# Altium schematic sheet Kilobot_Controller_Hub&FTDI.SchDoc
size A4; PageSetup: Record=PageOptions|CenterHorizontal=True|CenterVertical=True|PrintScale=0.94|XCorrection=1.00|YCorrection=1.00|PrintKind=1|BorderSize=5000000|LeftOffset=0|BottomOffset=0|Orientation=2|PaperLength=1000|PaperWidth=1000|Scale=100|PaperSource=15|PrintQuality=600|MediaType=1|DitherType=10|PaperKind=Letter|PrintScaleMode=1
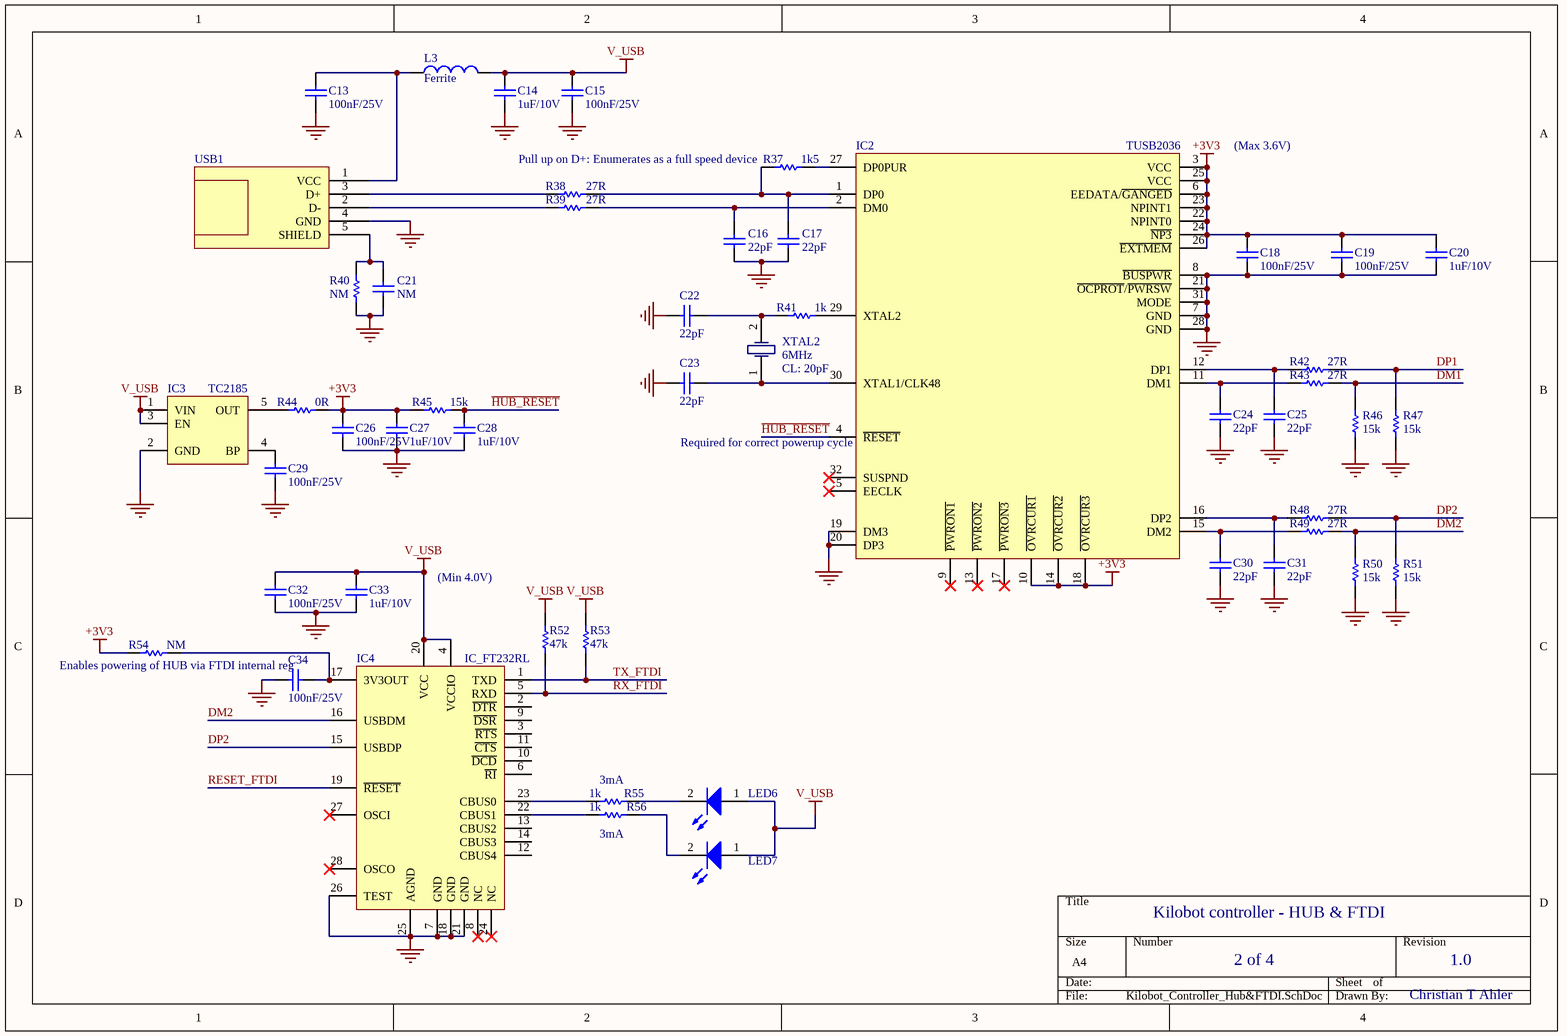
[diagram p0: Kilobot_Controller_Hub&FTDI.SchDoc]

## Parts
C13  value 100nF/25V  [RESC1608L]  (hidden comment: C0603)
C14  value 1uF/10V  [RESC1608L]  (hidden comment: C0603)
C15  value 100nF/25V  [RESC1608L]  (hidden comment: C0603)
C16  value 22pF  [RESC1608L]  (hidden comment: C0603)
C17  value 22pF  [RESC1608L]  (hidden comment: C0603)
C18  value 100nF/25V  [RESC1608L]  (hidden comment: C0603)
C19  value 100nF/25V  [RESC1608L]  (hidden comment: C0603)
C20  value 1uF/10V  [RESC1608L]  (hidden comment: C0603)
C21  value NM  [RESC1608L]  (hidden comment: C0603)
C22  value 22pF  [RESC1608L]  (hidden comment: C0603)
C23  value 22pF  [RESC1608L]  (hidden comment: C0603)
C24  value 22pF  [RESC1608L]  (hidden comment: C0603)
C25  value 22pF  [RESC1608L]  (hidden comment: C0603)
C26  value 100nF/25V  [RESC1608L]  (hidden comment: C0603)
C27  value 1uF/10V  [RESC1608L]  (hidden comment: C0603)
C28  value 1uF/10V  [RESC1608L]  (hidden comment: C0603)
C29  value 100nF/25V  [RESC1608L]  (hidden comment: C0603)
C30  value 22pF  [RESC1608L]  (hidden comment: C0603)
C31  value 22pF  [RESC1608L]  (hidden comment: C0603)
C32  value 100nF/25V  [RESC1608L]  (hidden comment: C0603)
C33  value 1uF/10V  [RESC1608L]  (hidden comment: C0603)
C34  value 100nF/25V  [RESC1608L]  (hidden comment: C0603)
IC2  TUSB2036  [TQFP32]
IC3  TC2185  [SOT23-5]
IC4  IC_FT232RL  [SSOP-28]
L3  Ferrite  [RESC2012N]
LED6  LED  [LED0603]  (value not drawn)
LED7  LED  [LED0603]  (value not drawn)
R37  value 1k5  [RESC1608L]  (hidden comment: Res1)
R38  value 27R  [RESC1608L]  (hidden comment: Res1)
R39  value 27R  [RESC1608L]  (hidden comment: Res1)
R40  value NM  [RESC1608L]  (hidden comment: Res1)
R41  value 1k  [RESC1608L]  (hidden comment: Res1)
R42  value 27R  [RESC1608L]  (hidden comment: Res1)
R43  value 27R  [RESC1608L]  (hidden comment: Res1)
R44  value 0R  [RESC1608L]  (hidden comment: Res1)
R45  value 15k  [RESC1608L]  (hidden comment: Res1)
R46  value 15k  [RESC1608L]  (hidden comment: Res1)
R47  value 15k  [RESC1608L]  (hidden comment: Res1)
R48  value 27R  [RESC1608L]  (hidden comment: Res1)
R49  value 27R  [RESC1608L]  (hidden comment: Res1)
R50  value 15k  [RESC1608L]  (hidden comment: Res1)
R51  value 15k  [RESC1608L]  (hidden comment: Res1)
R52  value 47k  [RESC1608L]  (hidden comment: Res1)
R53  value 47k  [RESC1608L]  (hidden comment: Res1)
R54  value NM  [RESC1608L]  (hidden comment: Res1)
R55  value 1k  [RESC1608L]  (hidden comment: Res1)
R56  value 1k  [RESC1608L]  (hidden comment: Res1)
USB1  USB  [USB_Vertical]  (value not drawn)
XTAL2  value 6MHz  CL: 20pF  [CrystalSMD]  (hidden comment: CrystalSMD)

## Nets
+3V3: C18.2 C19.2 C20.2 C26.2 C27.2 IC2.3(VCC) IC2.6(EEDATA/~{GANGED}) IC2.10(~{OVRCUR1}) IC2.14(~{OVRCUR2}) IC2.18(~{OVRCUR3}) IC2.22(NPINT0) IC2.23(NPINT1) IC2.24(~{NP3}) IC2.25(VCC) IC2.26(~{EXTMEM}) R44.1 R45.2 R54.2
GND: C13.1 C14.2 C15.1 C16.1 C17.1 C18.1 C19.1 C20.1 C21.2 C22.1 C23.1 C24.1 C25.1 C26.1 C27.1 C28.1 C29.2 C30.1 C31.1 C32.2 C33.1 C34.2 IC2.7(GND) IC2.8(~{BUSPWR}) IC2.19(DM3) IC2.20(DP3) IC2.21(~{OCPROT}/~{PWRSW}) IC2.28(GND) IC2.31(MODE) IC3.2(GND) IC4.7(GND) IC4.18(GND) IC4.21(GND) IC4.25(AGND) IC4.26(TEST) R40.2 R46.2 R47.2 R50.2 R51.2 USB1.4(GND)
V_USB: C14.1 C15.2 C32.1 C33.2 IC3.1(VIN) IC3.3(EN) IC4.4(VCCIO) IC4.20(VCC) L3.2 LED6.1(A) LED7.1(A) R52.2 R53.2
DM1: R43.1 R46.1
DM2: IC4.16(USBDM) R49.1 R50.1
DP1: R42.1 R47.1
DP2: IC4.15(USBDP) R48.1 R51.1
~{HUB_RESET}: C28.2 IC2.4(~{RESET}) R45.1
RESET_FTDI: IC4.19(~{RESET})
RX_FTDI: IC4.5(RXD) R52.1
TX_FTDI: IC4.1(TXD) R53.1
NetC13_2: C13.2 L3.1 USB1.1(VCC)
NetC16_2: C16.2 IC2.2(DM0) R39.1
NetC17_2: C17.2 IC2.1(DP0) R37.2 R38.1
NetC21_1: C21.1 R40.1 USB1.5(SHIELD)
NetC22_2: C22.2 R41.2 XTAL2.2
NetC23_2: C23.2 IC2.30(XTAL1/CLK48) XTAL2.1
NetC24_2: C24.2 IC2.11(DM1) R43.2
NetC25_2: C25.2 IC2.12(DP1) R42.2
NetC29_1: C29.1 IC3.4(BP)
NetC30_2: C30.2 IC2.15(DM2) R49.2
NetC31_2: C31.2 IC2.16(DP2) R48.2
NetC34_1: C34.1 IC4.17(3V3OUT) R54.1
NetIC2_27: IC2.27(DP0PUR) R37.1
NetIC2_29: IC2.29(XTAL2) R41.1
NetIC3_5: IC3.5(OUT) R44.2
NetIC4_22: IC4.22(CBUS1) R56.1
NetIC4_23: IC4.23(CBUS0) R55.1
NetLED6_2: LED6.2(K) R55.2
NetLED7_2: LED7.2(K) R56.2
NetR38_2: R38.2 USB1.3(D+)
NetR39_2: R39.2 USB1.2(D-)

Not connected (* = marked no-connect by the designer): IC2 5(EECLK)* 9(~{PWRON1})* 13(~{PWRON2})* 17(~{PWRON3})* 32(SUSPND)*; IC4 2(~{DTR}) 3(~{RTS}) 6(~{RI}) 8(NC)* 9(~{DSR}) 10(~{DCD}) 11(~{CTS}) 12(CBUS4) 13(CBUS2) 14(CBUS3) 24(NC)* 27(OSCI)* 28(OSCO)*

## Notes on the sheet
- (near R37) Pull up on D+: Enumerates as a full speed device
- (Max 3.6V)
- (near IC2) Required for correct powerup cycle
- (Min 4.0V)
- Enables powering of HUB via FTDI internal reg
- (near R55) 3mA
- (near R56) 3mA
- Kilobot controller - HUB & FTDI
- 2 of 4
- 1.0
- Christian T Ahler

## Library data of the parts
C13 C15 C18 C19 C26 C29 C32 C34 = C0603: Ceramic Chip Capacitor - Standard; Order code: 445-1316-1-ND
C14 C20 C27 C28 C33 = C0603: Ceramic Chip Capacitor - Standard; Order code: 445-1328-1-ND
C16 C17 C22-C25 C30 C31 = C0603: Ceramic Chip Capacitor - Standard; Order code: 445-1273-1-ND
C21 = C0603: Ceramic Chip Capacitor - Standard; Order code: DNO
IC2 = TUSB2036: Order code: 296-27129-1-ND; Value: TUSB2036
IC3 = TC2185: Value: LDO; Order code: TC2185-3.3VCCT-ND
IC4 = IC_FT232RL: FT232R USB UART; Value: FTDI USB; Order code: 768-1007-1-ND
L3 = Inductor: Value: 1k @ 100MHz; Order code: 445-5223-1-ND
LED6 LED7 = LED: Value: LED Green; Order code: 475-1409-1-ND
R37 = Res1: Resistor; Order code: P1.5KGCT-ND
R38 R39 R42 R43 R48 R49 = Res1: Resistor; Order code: P27GCT-ND
R40 R54 = Res1: Resistor; Order code: DNO
R41 R55 R56 = Res1: Resistor; Order code: P1.00KHCT-ND
R44 = Res1: Resistor; Order code: RMCF0603ZT0R00CT-ND
R45-R47 R50 R51 = Res1: Resistor; Order code: P15KGCT-ND
R52 R53 = Res1: Resistor; Order code: P47.0KHCT-ND
USB1 = USB: Value: USB Connector; Order code: 151-1083-ND
XTAL2 = CrystalSMD: Order code: XC1000CT-ND